# Altium project FIT_PM_TCM_Emulator.PrjPcb (part 4 of 4)

## Sheet CLK_GEN.SchDoc
size A3; SheetNumber: 8; SheetTotal: 8
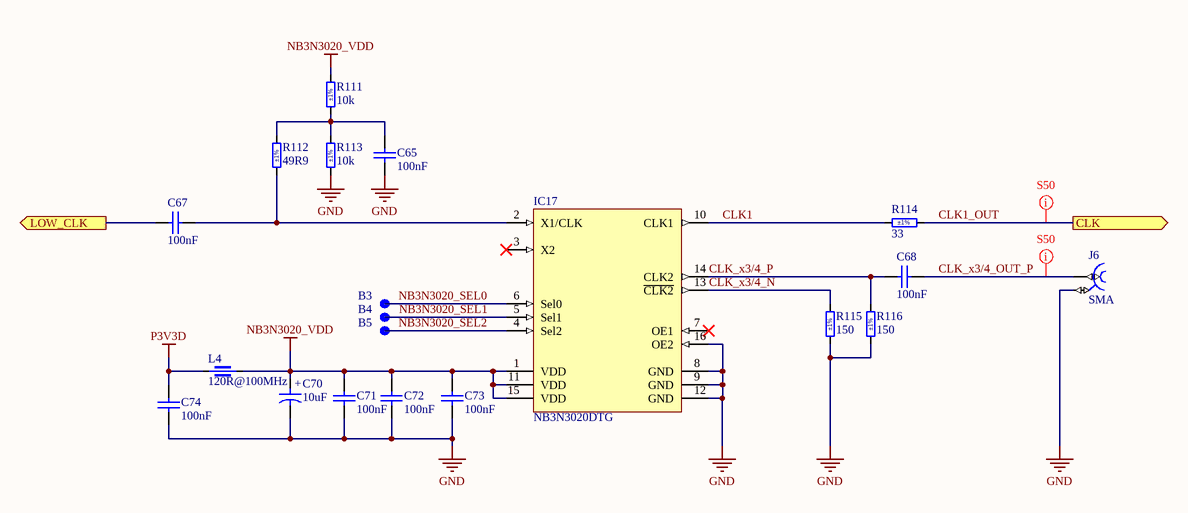
[diagram p7: CLK_GEN.SchDoc]

### Parts
B3  SMD Pad  [C100]  (value not drawn)  (no BOM)
B4  SMD Pad  [C100]  (value not drawn)  (no BOM)
B5  SMD Pad  [C100]  (value not drawn)  (no BOM)
C65  100nF  [CAPC1005X55N]
C67  100nF  [CAPC1005X55N]
C68  100nF  [CAPC1005X55N]
C70  10uF  [CAPMP3216X180N]
C71  100nF  [CAPC1005X55N]
C72  100nF  [CAPC1005X55N]
C73  100nF  [CAPC1005X55N]
C74  100nF  [CAPC1005X55N]
IC17  NB3N3020DTG  [TSOP65P640X120-16N]
J6  SMA  [MOLEX_73251-2120]
L4  120R@100MHz  [INDC1608X65N]
R111  10k  Tolerance: ±1%  [RESC1005X40N]
R112  49R9  Tolerance: ±1%  [RESC1005X40N]
R113  10k  Tolerance: ±1%  [RESC1005X40N]
R114  33  Tolerance: ±1%  [RESC1005X40N]
R115  150  Tolerance: ±1%  [RESC1005X40N]
R116  150  Tolerance: ±1%  [RESC1005X40N]

### Ports
CLK (out, see BLOCK_DIAGRAM[4B], REDRIVERS[4D]), LOW_CLK (out, see BLOCK_DIAGRAM[4B], REDRIVERS[4C])

### Nets
GND: C65.1 C70.2 C71.1 C72.1 C73.1 C74.1 IC17.8(GND) IC17.9(GND) IC17.12(GND) IC17.16(OE2) J6.2 R113.1 R115.1 R116.1
NB3N3020_VDD: C70.1 C71.2 C72.2 C73.2 IC17.1(VDD) IC17.11(VDD) IC17.15(VDD) L4.2 R111.2
P3V3D: C74.2 L4.1
CLK1: IC17.10(CLK1) R114.1
CLK1_OUT: R114.2 ; port CLK  [project net 240MHz]
CLK_x3/4_N: IC17.13(~{CLK2}) R115.2
CLK_x3/4_OUT_P: C68.2 J6.1
CLK_x3/4_P: C68.1 IC17.14(CLK2) R116.2
NB3N3020_SEL0: B3.1 IC17.6(Sel0)
NB3N3020_SEL1: B4.1 IC17.5(Sel1)
NB3N3020_SEL2: B5.1 IC17.4(Sel2)
NetC65_2: C65.2 R111.1 R112.2 R113.2
NetC67_1: C67.1 ; port LOW_CLK
NetC67_2: C67.2 IC17.2(X1/CLK) R112.1

Not connected (* = marked no-connect by the designer): IC17 3(X2)* 7(OE1)*

### Layout directives
net class S50: 240MHz, CLK_x3/4_OUT_P

### Notes on the sheet
- (in symbol CTE3216-18_10UF_16V_20%_AVX_TCJ) +

### Library data of the parts
B3-B5 = SMD_PAD_D1MM: Pad; Part Description: 1mm Diameter SMD Pad; Mounted: No; Part Number: SMD_PAD_D1MM; Component Type: Standard (No BOM); Pin Count: 1; Family: SMD Pad; Socket: No; SMD: Yes; Sense: No; Status: None; ComponentHeight: 0mm; HelpURL: Undefined; Author: CERN DEM JLC; CreateDate: 10/10/2017; LatestRevisionDate: 10/10/2017; PackageDescription: 1mm Diameter SMD Pad
C65 C67 C68 C71-C74 = CC0402_100NF_50V_10%_X7R: Non-polarised capacitor; Part Description: SMD Multilayer Chip Ceramic Capacitor; Manufacturer: GENERIC; Manufacturer1 Part Number: GRM155R71H104KE14D; Voltage: 50V; TC: X7R; Tolerance: ±10%; Part Number: CC0402_100NF_50V_10%_X7R; Component Kind: Standard; Component Type: Standard; Pin Count: 2; Value: 100nF; Status: None; Manufacturer Part Number: CC0402_100NF_50V_10%_X7R; Case: 0402; Mounted: Yes; Socket: No; SMD: Yes; Sense: No; Manufacturer1 Example: MURATA; Manufacturer1 ComponentHeight: 0.55mm; HelpURL: \\cern.ch\dfs\Applications\Altium\Datasheets\CC0402_MURATA_GRM155R71H104KE14D.pdf; Author: CERN DEM MR; CreateDate: 6/30/2017; LatestRevisionDate: 6/30/2017
C70 = CTE3216-18_10UF_16V_20%_AVX_TCJ: Polarised capacitor; Part Description: ESR 0R200 Tantalum Solid Electrolytic Chip Capacitor with Conductive Polymer Electrode; Manufacturer: AVX; Manufacturer Part Number: TCJA106M016R0200; Voltage: 16V; Tolerance: ±20%; Part Number: CTE3216-18_10UF_16V_20%_AVX_TCJ; Component Kind: Standard; Component Type: Standard; Pin Count: 2; Value: 10uF; Status: Preferred; Case: A; Mounted: Yes; Socket: No; SMD: Yes; Sense: No; ComponentHeight: 1.8mm; HelpURL: \\cern.ch\dfs\Applications\Altium\Datasheets\CTE_AVX_TCJ.pdf; Author: CERN DEM JLC; CreateDate: 3/29/2012; LatestRevisionDate: 3/29/2012
IC17 = NB3N3020DTG: Clock Generator 2MHz to 210MHz Input 210MHz Output 16-Pin TSSOP Tube; Manufacturer: ON Semiconductor; Supplier: Digikey; Supplier Part Number: NB3N3020DTGOS-ND; Manufacturer Part Number: NB3N3020DTG; RoHS: Yes; Category: Clock Generators, PLLs, Frequency Synthesizers; Stock: 1304; Pricing: 1=10.69, 10=9.654, 96=7.9925, 288=7.63326, 576=6.95974, 1056=6.06171 (USD); ComponentLink1URL: https://datasheet.ciiva.com/12072/nb3n3020-d-112477-12072970.pdf?src-supplier=Mouser; ComponentLink1Description: https://datasheet.ciiva.com/12072/nb3n3020-d-112477-12072970.pdf?src-supplier=Mouser; ComponentLink2URL: https://datasheet.ciiva.com/15153/getdatasheetpartid-556163-15153893.pdf?src-supplier=Verical; ComponentLink2Description: https://datasheet.ciiva.com/15153/getdatasheetpartid-556163-15153893.pdf?src-supplier=Verical
J6 = CON_SMA_RA_SMD_73251-2120: 50 Ohm, SMA Edge Mount PCB, With Jam Nut And Lock Washer; Manufacturer: MOLEX; PressFit: No; Part Number: MOLEX_73251-2120; Component Kind: Standard; Component Type: Standard; Pin Count: 5; Family: SMA; Mounted: Yes; Socket: No; SMD: Yes; Sense: No; Status: None; Part Description: 50 Ohm, SMA Edge Mount PCB, With Jam Nut And Lock Washer; Manufacturer Part Number: 73251-2120; ComponentHeight: 5.75mm; HelpURL: \\cern.ch\dfs\Applications\Altium\Datasheets\MOLEX_73251-2121.pdf; Author: CERN DEM JLC; CreateDate: 26.10.2016; LatestRevisionDate: 26.10.2016
L4 = IND0603_MURATA_BLM18SG121TN1D: Part Description: SMD EMIFIL Suppression Chip Ferrite Bead; Manufacturer: MURATA; Power: 3A; Resistance: 0.025R; Tolerance: ±25%; Part Number: IND0603_MURATA_BLM18SG121TN1D; Component Kind: Standard; Component Type: Standard; Pin Count: 2; Value: 120R@100MHz; Manufacturer Part Number: BLM18SG121TN1D; Case: 0603; Mounted: Yes; Socket: No; SMD: Yes; Sense: No; ComponentHeight: 0.65mm; HelpURL: \\cern.ch\dfs\Applications\Altium\Datasheets\IND0603_MURATA_BLM18S.pdf; Author: CERN DEM JLC; CreateDate: 7/23/2014; LatestRevisionDate: 10/25/2018
R111 R113 = R0402_10K_1%_0.0625W_100PPM: Resistor - 1%; Part Description: General Purpose Thick Film Chip Resistor; Manufacturer: GENERIC; Manufacturer1 Part Number: 232270671003L; TC: ±100ppm/°C; PressFit: No; Part Number: R0402_10K_1%_0.0625W_100PPM; Component Kind: Standard; Component Type: Standard; Pin Count: 2; Value: 10k; Status: Not Recommended; Power: 0.0625W; Manufacturer Part Number: R0402_10K_1%_0.0625W_100PPM; Case: 0402; Mounted: Yes; Sense: No; Socket: No; SMD: Yes; Manufacturer1 Example: YAGEO PHYCOMP; Manufacturer1 ComponentHeight: 0.4mm; HelpURL: \\cern.ch\dfs\Applications\Altium\Datasheets\R0402_Phycomp_RC0402.pdf; Author: CERN DEM JLC; CreateDate: 12/3/2007; LatestRevisionDate: 10/17/2012
R112 = R0402_49R9_1%_0.0625W_100PPM: Resistor - 1%; Part Description: General Purpose Thick Film Chip Resistor; Manufacturer: GENERIC; Manufacturer1 Part Number: 232270674999L or RC0402FR-0749R9L; TC: ±100ppm/°C; PressFit: No; Part Number: R0402_49R9_1%_0.0625W_100PPM; Component Kind: Standard; Component Type: Standard; Pin Count: 2; Value: 49R9; Status: Not Recommended; Power: 0.0625W; Manufacturer Part Number: R0402_49R9_1%_0.0625W_100PPM; Case: 0402; Mounted: Yes; Sense: No; Socket: No; SMD: Yes; Manufacturer1 Example: YAGEO PHYCOMP; Manufacturer1 ComponentHeight: 0.4mm; HelpURL: \\cern.ch\dfs\Applications\Altium\Datasheets\R0402_Phycomp_RC0402.pdf; Author: CERN DEM JLC; CreateDate: 10/24/2012; LatestRevisionDate: 10/24/2012
R114 = R0402_33R_1%_0.0625W_100PPM: Resistor - 1%; Part Description: General Purpose Thick Film Chip Resistor; Manufacturer: GENERIC; Manufacturer1 Part Number: 232270673309L; TC: ±100ppm/°C; PressFit: No; Part Number: R0402_33R_1%_0.0625W_100PPM; Component Kind: Standard; Component Type: Standard; Pin Count: 2; Value: 33; Status: Not Recommended; Power: 0.0625W; Manufacturer Part Number: R0402_33R_1%_0.0625W_100PPM; Case: 0402; Mounted: Yes; Sense: No; Socket: No; SMD: Yes; Manufacturer1 Example: YAGEO PHYCOMP; Manufacturer1 ComponentHeight: 0.4mm; HelpURL: \\cern.ch\dfs\Applications\Altium\Datasheets\R0402_Phycomp_RC0402.pdf; Author: CERN DEM JLC; CreateDate: 12/3/2007; LatestRevisionDate: 10/17/2012
R115 R116 = R0402_150R_1%_0.0625W_100PPM: Resistor - 1%; Part Description: General Purpose Thick Film Chip Resistor; Manufacturer: GENERIC; Manufacturer1 Part Number: 232270671501L; TC: ±100ppm/°C; PressFit: No; Part Number: R0402_150R_1%_0.0625W_100PPM; Component Kind: Standard; Component Type: Standard; Pin Count: 2; Value: 150; Status: Not Recommended; Power: 0.0625W; Manufacturer Part Number: R0402_150R_1%_0.0625W_100PPM; Case: 0402; Mounted: Yes; Sense: No; Socket: No; SMD: Yes; Manufacturer1 Example: YAGEO PHYCOMP; Manufacturer1 ComponentHeight: 0.4mm; HelpURL: \\cern.ch\dfs\Applications\Altium\Datasheets\R0402_Phycomp_RC0402.pdf; Author: CERN DEM JLC; CreateDate: 12/3/2007; LatestRevisionDate: 10/17/2012

## Nets that join several sheets
GND: FRONT_CONN (30 pins), REDRIVERS (33 pins), DIOT_CONN (53 pins), EEM_CONN (18 pins), PSU (60 pins), SYSTEM (20 pins), CLK_GEN (14 pins)
P3V3_DIOT: EEM_CONN (J7.30 J8.30), PSU (8 pins), SYSTEM (16 pins)
P3V3D: FRONT_CONN (17 pins), REDRIVERS (28 pins), PSU (32 pins), CLK_GEN (C74.2 L4.1)
240MHz: REDRIVERS (IC13.6 IC14.7 IC16.6 IC18.6), CLK_GEN (R114.2)
DIOT_I2C.SCL: DIOT_CONN (D2.1 J1.B2), SYSTEM (IC8.8 IC8.11 R109.2)
DIOT_I2C.SDA: DIOT_CONN (D2.3 J1.C2), SYSTEM (IC8.1 IC8.4 R108.2)
DIOT_LVDS0_N: REDRIVERS (R15.1), DIOT_CONN (J1.E3)
DIOT_LVDS0_P: REDRIVERS (R13.1), DIOT_CONN (J1.D3)
DIOT_LVDS1_N: REDRIVERS (R19.1), DIOT_CONN (J1.B3)
DIOT_LVDS1_P: REDRIVERS (R17.1), DIOT_CONN (J1.A3)
DIOT_LVDS2_N: REDRIVERS (R23.1), DIOT_CONN (J1.C4)
DIOT_LVDS2_P: REDRIVERS (R21.1), DIOT_CONN (J1.B4)
DIOT_LVDS3_N: REDRIVERS (R27.1), DIOT_CONN (J1.L4)
DIOT_LVDS3_P: REDRIVERS (R25.1), DIOT_CONN (J1.K4)
DIOT_LVDS4_N: REDRIVERS (R31.1), DIOT_CONN (J1.I4)
DIOT_LVDS4_P: REDRIVERS (R29.1), DIOT_CONN (J1.H4)
DIOT_LVDS5_N: REDRIVERS (R35.1), DIOT_CONN (J1.K5)
DIOT_LVDS5_P: REDRIVERS (R33.1), DIOT_CONN (J1.J5)
DIOT_LVDS6_N: REDRIVERS (R39.1), DIOT_CONN (J1.H5)
DIOT_LVDS6_P: REDRIVERS (R37.1), DIOT_CONN (J1.G5)
DIOT_LVDS7_N: REDRIVERS (R43.1), DIOT_CONN (J1.F6)
DIOT_LVDS7_P: REDRIVERS (R41.1), DIOT_CONN (J1.E6)
DIOT_LVDS8_N: REDRIVERS (R16.1), DIOT_CONN (J1.C6)
DIOT_LVDS8_P: REDRIVERS (R14.1), DIOT_CONN (J1.B6)
DIOT_LVDS9_N: REDRIVERS (R20.1), DIOT_CONN (J1.L6)
DIOT_LVDS9_P: REDRIVERS (R18.1), DIOT_CONN (J1.K6)
DIOT_LVDS10_N: REDRIVERS (R24.1), DIOT_CONN (J1.I6)
DIOT_LVDS10_P: REDRIVERS (R22.1), DIOT_CONN (J1.H6)
DIOT_LVDS11_N: REDRIVERS (R28.1), DIOT_CONN (J2.E1)
DIOT_LVDS11_P: REDRIVERS (R26.1), DIOT_CONN (J2.D1)
DIOT_LVDS12_N: REDRIVERS (R32.1), DIOT_CONN (J2.B1)
DIOT_LVDS12_P: REDRIVERS (R30.1), DIOT_CONN (J2.A1)
DIOT_LVDS13_N: REDRIVERS (R36.1), DIOT_CONN (J2.K1)
DIOT_LVDS13_P: REDRIVERS (R34.1), DIOT_CONN (J2.J1)
DIOT_LVDS14_N: REDRIVERS (R40.1), DIOT_CONN (J2.H1)
DIOT_LVDS14_P: REDRIVERS (R38.1), DIOT_CONN (J2.G1)
DIOT_LVDS15_N: REDRIVERS (R44.1), DIOT_CONN (J1.F2)
DIOT_LVDS15_P: REDRIVERS (R42.1), DIOT_CONN (J1.E2)
EEM0_I2C.SCL: EEM_CONN (J7.27), SYSTEM (R105.2)
EEM0_I2C.SDA: EEM_CONN (J7.26), SYSTEM (R104.2)
EEM1_I2C.SCL: EEM_CONN (J8.27), SYSTEM (R107.2)
EEM1_I2C.SDA: EEM_CONN (J8.26), SYSTEM (R106.2)
EEM_12V: EEM_CONN (J7.28 J7.29 J8.28 J8.29), PSU (F2.1)
EEM_LVDS0_N: REDRIVERS (IC3.7 IC10.2 R15.2), EEM_CONN (J7.3)
EEM_LVDS0_P: REDRIVERS (IC3.8 IC10.1 R13.2), EEM_CONN (J7.2)
EEM_LVDS1_N: REDRIVERS (IC10.5 R19.2), EEM_CONN (J7.6)
EEM_LVDS1_P: REDRIVERS (IC10.4 R17.2), EEM_CONN (J7.5)
EEM_LVDS2_N: REDRIVERS (IC10.7 R23.2), EEM_CONN (J7.9)
EEM_LVDS2_P: REDRIVERS (IC10.6 R21.2), EEM_CONN (J7.8)
EEM_LVDS3_N: REDRIVERS (IC10.10 R27.2), EEM_CONN (J7.12)
EEM_LVDS3_P: REDRIVERS (IC10.9 R25.2), EEM_CONN (J7.11)
EEM_LVDS4_N: REDRIVERS (R31.2), EEM_CONN (J7.15)
EEM_LVDS4_P: REDRIVERS (R29.2), EEM_CONN (J7.14)
EEM_LVDS5_N: REDRIVERS (R35.2), EEM_CONN (J7.18)
EEM_LVDS5_P: REDRIVERS (R33.2), EEM_CONN (J7.17)
EEM_LVDS6_N: REDRIVERS (R39.2), EEM_CONN (J7.21)
EEM_LVDS6_P: REDRIVERS (R37.2), EEM_CONN (J7.20)
EEM_LVDS7_N: REDRIVERS (R43.2), EEM_CONN (J7.24)
EEM_LVDS7_P: REDRIVERS (R41.2), EEM_CONN (J7.23)
EEM_LVDS8_N: REDRIVERS (IC2.7 R16.2), EEM_CONN (J8.3)
EEM_LVDS8_P: REDRIVERS (IC2.8 R14.2), EEM_CONN (J8.2)
EEM_LVDS9_N: REDRIVERS (IC11.2 R20.2), EEM_CONN (J8.6)
EEM_LVDS9_P: REDRIVERS (IC11.1 R18.2), EEM_CONN (J8.5)
EEM_LVDS10_N: REDRIVERS (IC11.5 R24.2), EEM_CONN (J8.9)
EEM_LVDS10_P: REDRIVERS (IC11.4 R22.2), EEM_CONN (J8.8)
EEM_LVDS11_N: REDRIVERS (IC11.7 R28.2), EEM_CONN (J8.12)
EEM_LVDS11_P: REDRIVERS (IC11.6 R26.2), EEM_CONN (J8.11)
EEM_LVDS12_N: REDRIVERS (IC11.10 R32.2), EEM_CONN (J8.15)
EEM_LVDS12_P: REDRIVERS (IC11.9 R30.2), EEM_CONN (J8.14)
EEM_LVDS13_N: REDRIVERS (IC12.1 R36.2), EEM_CONN (J8.18)
EEM_LVDS13_P: REDRIVERS (IC12.2 R34.2), EEM_CONN (J8.17)
EEM_LVDS14_N: REDRIVERS (IC12.4 R40.2), EEM_CONN (J8.21)
EEM_LVDS14_P: REDRIVERS (IC12.3 R38.2), EEM_CONN (J8.20)
EEM_LVDS15_N: REDRIVERS (IC14.9 R44.2), EEM_CONN (J8.24)
EEM_LVDS15_P: REDRIVERS (IC14.10 R42.2), EEM_CONN (J8.23)
FRONT_CLK_PM1_N: FRONT_CONN (J3.19), REDRIVERS (IC3.3)
FRONT_CLK_PM1_P: FRONT_CONN (J3.14), REDRIVERS (IC3.2)
FRONT_CLK_PM2_N: FRONT_CONN (J5.19), REDRIVERS (IC2.3)
FRONT_CLK_PM2_P: FRONT_CONN (J5.14), REDRIVERS (IC2.2)
FRONT_LVDS0_N: FRONT_CONN (J3.3), REDRIVERS (IC10.28)
FRONT_LVDS0_P: FRONT_CONN (J3.1), REDRIVERS (IC10.29)
FRONT_LVDS1_N: FRONT_CONN (J3.6), REDRIVERS (IC10.26)
FRONT_LVDS1_P: FRONT_CONN (J3.4), REDRIVERS (IC10.27)
FRONT_LVDS2_N: FRONT_CONN (J3.9), REDRIVERS (IC10.23)
FRONT_LVDS2_P: FRONT_CONN (J3.7), REDRIVERS (IC10.24)
FRONT_LVDS3_N: FRONT_CONN (J3.12), REDRIVERS (IC10.21)
FRONT_LVDS3_P: FRONT_CONN (J3.10), REDRIVERS (IC10.22)
FRONT_LVDS4_N: FRONT_CONN (J5.3), REDRIVERS (IC11.28)
FRONT_LVDS4_P: FRONT_CONN (J5.1), REDRIVERS (IC11.29)
FRONT_LVDS5_N: FRONT_CONN (J5.6), REDRIVERS (IC11.26)
FRONT_LVDS5_P: FRONT_CONN (J5.4), REDRIVERS (IC11.27)
FRONT_LVDS6_N: FRONT_CONN (J5.9), REDRIVERS (IC11.23)
FRONT_LVDS6_P: FRONT_CONN (J5.7), REDRIVERS (IC11.24)
FRONT_LVDS7_N: FRONT_CONN (J5.12), REDRIVERS (IC11.21)
FRONT_LVDS7_P: FRONT_CONN (J5.10), REDRIVERS (IC11.22)
FRONT_TTL_0: FRONT_CONN (J3.13 R117.1 R121.2), REDRIVERS (IC4.2)
FRONT_TTL_1: FRONT_CONN (J3.15 R118.1 R122.2), REDRIVERS (IC4.3)
FRONT_TTL_2: FRONT_CONN (J3.16 R119.1 R123.2), REDRIVERS (IC4.6 R92.2)
FRONT_TTL_4: FRONT_CONN (J5.13 R65.1 R73.2), REDRIVERS (IC14.2)
FRONT_TTL_5: FRONT_CONN (J5.15 R66.1 R74.2), REDRIVERS (IC14.3)
FRONT_TTL_6: FRONT_CONN (J5.16 R67.1 R75.2), REDRIVERS (IC14.6 R93.2)
FRONT_TTL_8: FRONT_CONN (R59.2), SYSTEM (IC15.11)
FRONT_TTL_9: FRONT_CONN (R60.2), SYSTEM (IC15.10)
FRONT_TTL_10: FRONT_CONN (R69.2), SYSTEM (IC15.9)
FRONT_TTL_11: FRONT_CONN (R70.2), SYSTEM (IC15.7)
FRONT_TTL_12: FRONT_CONN (R71.2), SYSTEM (IC15.6)
FRONT_TTL_13: FRONT_CONN (R72.2), SYSTEM (IC15.5)
GA0: DIOT_CONN (R1.1), SYSTEM (IC6.13 R48.2)
GA1: DIOT_CONN (R2.1), SYSTEM (IC6.5 R52.2)
GA2: DIOT_CONN (R8.1), SYSTEM (IC6.12 R126.2)
GA3: DIOT_CONN (R12.1), SYSTEM (IC6.6 R125.2)
NetC1_2: DIOT_CONN (7 pins), PSU (C1.2 F1.1 IC1.1 IC1.3)
NetC67_1: REDRIVERS (R94.2), CLK_GEN (C67.1)
NetJ4_1: FRONT_CONN (J4.1), REDRIVERS (R127.2)
nPWDN: REDRIVERS (10 pins), SYSTEM (IC15.12)
RST_N: DIOT_CONN (R4.1), PSU (IC5.1 R80.1), SYSTEM (D6.1 T1.3)
SERVMOD_3V3: DIOT_CONN (R10.1), SYSTEM (IC8.5 IC8.6 IC8.12 IC8.13)

## Assembly variants
DIOT: all parts fitted
SINARA: all parts fitted